# Altium schematic sheet keyboard.schdoc
size 146 x 220 mm
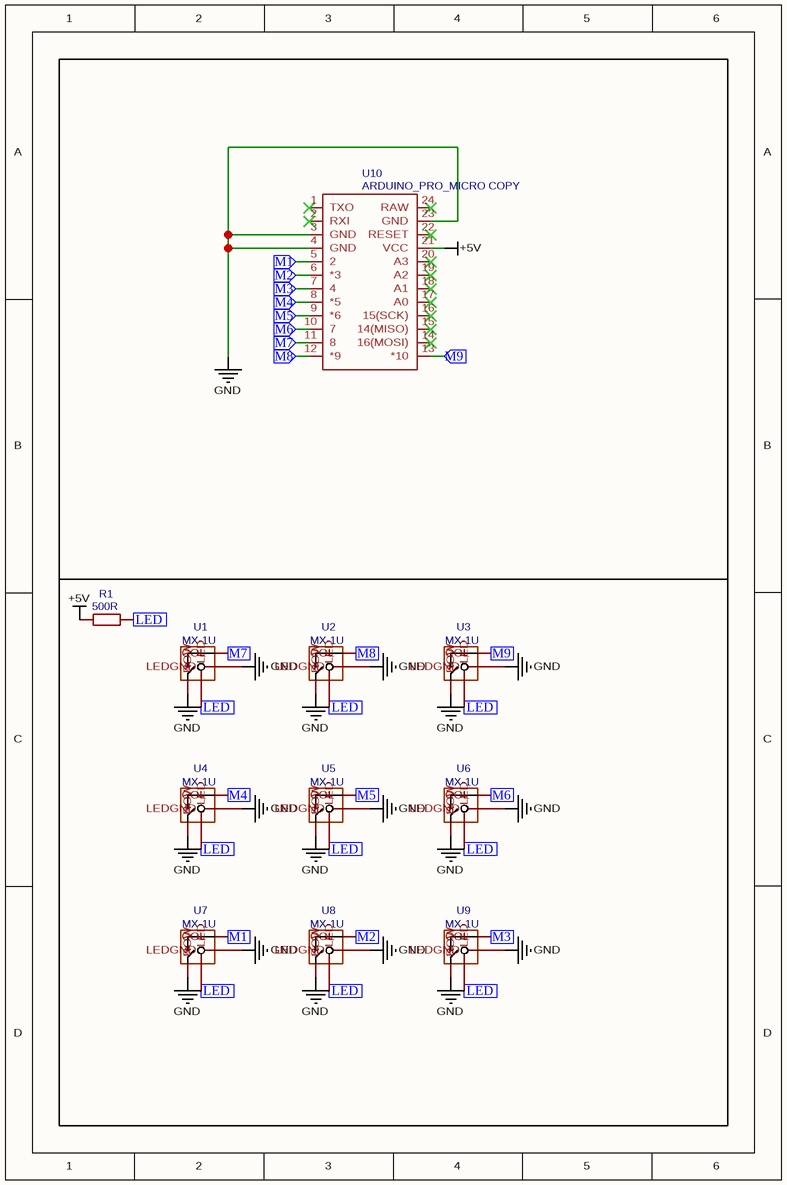
[diagram p0: keyboard.schdoc]

## Parts
R1  500R  [RES-TH_BD2.2-L6.5-P10.50-D0.6]
U1  MX-1U  [CHERRY_MX_1U]
U2  MX-1U  [CHERRY_MX_1U]
U3  MX-1U  [CHERRY_MX_1U]
U4  MX-1U  [CHERRY_MX_1U]
U5  MX-1U  [CHERRY_MX_1U]
U6  MX-1U  [CHERRY_MX_1U]
U7  MX-1U  [CHERRY_MX_1U]
U8  MX-1U  [CHERRY_MX_1U]
U9  MX-1U  [CHERRY_MX_1U]
U10  ARDUINO_PRO_MICRO COPY  [ARDUINO_PRO_MICRO]

## Ports
LED (in), M1 (in), M2 (in), M3 (in), M4 (in), M5 (in), M6 (in), M7 (in), M8 (in), M9 (in)

## Nets
+5V: R1.2 U10.21(VCC)
GND: U1.LEDGND U1.ROW U2.LEDGND U2.ROW U3.LEDGND U3.ROW U4.LEDGND U4.ROW U5.LEDGND U5.ROW U6.LEDGND U6.ROW U7.LEDGND U7.ROW U8.LEDGND U8.ROW U9.LEDGND U9.ROW U10.3(GND) U10.4(GND) U10.23(GND)
LED: R1.1 U1.LED U2.LED U3.LED U4.LED U5.LED U6.LED U7.LED U8.LED U9.LED ; port LED
M1: U7.COL U10.5(2) ; port M1
M2: U8.COL U10.6(*3) ; port M2
M3: U9.COL U10.7(4) ; port M3
M4: U4.COL U10.8(*5) ; port M4
M5: U5.COL U10.9(*6) ; port M5
M6: U6.COL U10.10(7) ; port M6
M7: U1.COL U10.11(8) ; port M7
M8: U2.COL U10.12(*9) ; port M8
M9: U3.COL U10.13(*10) ; port M9

Not connected (* = marked no-connect by the designer): U10 1(TXO)* 2(RXI)* 14(16(MOSI))* 15(14(MISO))* 16(15(SCK))* 17(A0)* 18(A1)* 19(A2)* 20(A3)* 22(RESET)* 24(RAW)*

## Library data of the parts
R1 = 500R: BOM_Manufacturer: YAGEO; BOM_Manufacturer Part: MFR-25FTE52-510K; nameAlias: Resistance (Ohms); Contributor: LCSC; BOM_Supplier: LCSC; BOM_Supplier Part: C173024; spicePre: R; spiceSymbolName: MFR-25FTE52-510K
U1-U9 = MX-1U: Contributor: Sliver; spicePre: U; spiceSymbolName: MX-1U COPY
U10 = ARDUINO_PRO_MICRO COPY: Contributor: SparkFun; spicePre: U; spiceSymbolName: ARDUINO_PRO_MICRO COPY